# EAGLE design programmer9.0 (EAGLE 6.3)
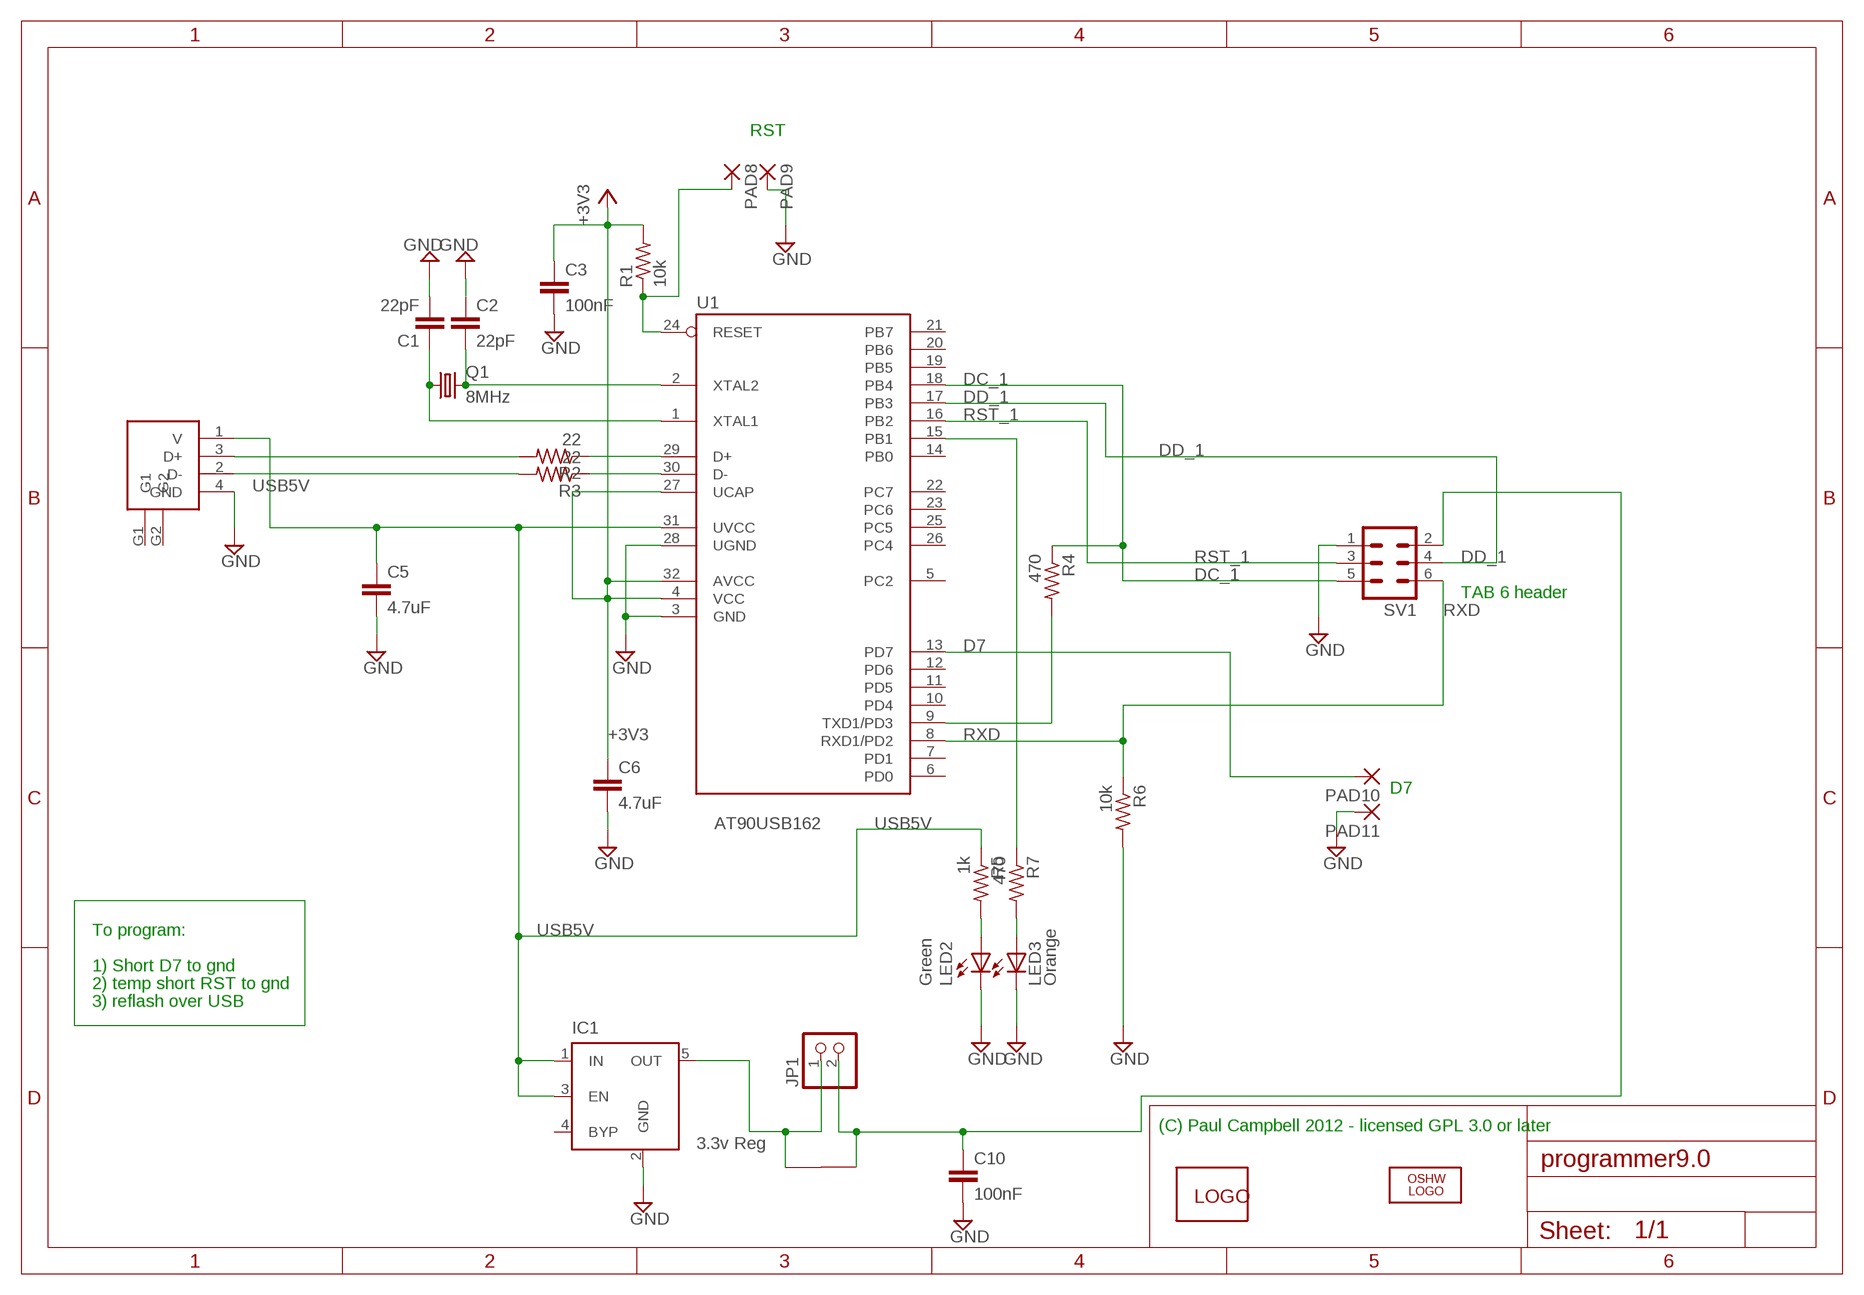
[diagram p0: schematic, sheet 1]

## Parts
C1  22pF  C-EUC0603  [C0603]
C2  22pF  C-EUC0603  [C0603]
C3  100nF  C-EUC0603  [C0603]
C5  4.7uF  C-EUC0805  [C0805]
C6  4.7uF  C-EUC0805  [C0805]
C10  100nF  C-EUC0603  [C0603]
IC1  3.3v Reg  MIC5219XX  [SOT23-5]
JP1  PINHD-1X2  [1X02]
LED2  Green  LEDCHIP-LED0805  [CHIP-LED0805]
LED3  Orange  LEDCHIP-LED0805  [CHIP-LED0805]
LOGO2  OSHW_LOGO_FILLX0100-NT  [OSHW_FILLX100_NOTEXT]
PAD8  1,6/0,8  [1,6/0,8]
PAD9  1,6/0,8  [1,6/0,8]
PAD10  1,6/0,8  [1,6/0,8]
PAD11  1,6/0,8  [1,6/0,8]
Q1  8MHz  CRYSTALHC49UP  [HC49UP]
R1  10k  R-US_R0603  [R0603]
R2  22  R-US_R0603  [R0603]
R3  22  R-US_R0603  [R0603]
R4  470  R-US_R0603  [R0603]
R5  1k  R-US_R0603  [R0603]
R6  10k  R-US_R0603  [R0603]
R7  470  R-US_R0603  [R0603]
SV1  MA03-2  [MA03-2]
U1  AT90USB162  [TQFP32-08]
U$1  LINK  [LINK]
U$2  MOONBASE-LOGO  [MOONBASE-LOGO]
U$3  USB-RAW  [USBY]

## Nets
+3V3: C3.1 C6.1 R1.2 U1.4(VCC) U1.27(UCAP) U1.32(AVCC)
D7: PAD10.1(P) U1.13(PD7)
DC_1: R4.1 SV1.5 U1.18(PB4)
DD_1: SV1.4 U1.17(PB3)
GND: C1.2 C2.1 C3.2 C5.2 C6.2 C10.2 IC1.2(GND) LED2.C LED3.C PAD9.1(P) PAD11.1(P) R6.2 SV1.1 U1.3(GND) U1.28(UGND) U$3.4(GND)
N$1: C1.1 Q1.1 U1.1(XTAL1)
N$2: C2.2 Q1.2 U1.2(XTAL2)
N$3: R2.1 U1.29(D+)
N$4: R3.1 U1.30(D-)
N$6: R4.2 U1.9(TXD1/PD3)
N$7: IC1.5(OUT) JP1.1 U$1.1
N$9: C10.1 JP1.2 SV1.2 U$1.2
N$10: R3.2 U$3.2(D-)
N$11: R2.2 U$3.3(D+)
N$18: LED2.A R5.2
N$22: LED3.A R7.2
N$23: R7.1 U1.15(PB1)
RST: PAD8.1(P) R1.1 U1.24(RESET)
RST_1: SV1.3 U1.16(PB2)
RXD: R6.1 SV1.6 U1.8(RXD1/PD2)
USB5V: C5.1 IC1.1(IN) IC1.3(EN) R5.1 U1.31(UVCC) U$3.1(V)
Unconnected: IC1.4(BYP) U1.5(PC2) U1.6(PD0) U1.7(PD1) U1.10(PD4) U1.11(PD5) U1.12(PD6) U1.14(PB0) U1.19(PB5) U1.20(PB6) U1.21(PB7) U1.22(PC7) U1.23(PC6) U1.25(PC5) U1.26(PC4) U$3.G1 U$3.G2

## Notes on the sheet
- RST
- TAB 6 header
- D7
- To program:
- 1) Short D7 to gnd
- 2) temp short RST to gnd
- 3) reflash over USB
- (C) Paul Campbell 2012 - licensed GPL 3.0 or later

## Library data of the parts
C1-C3 C5 C6 C10 = rcl:C-EU: CAPACITOR, European symbol
IC1 = v-reg-micrel:MIC5219XX: VOLTAGE REGULATOR; OC_FARNELL: unknown; OC_NEWARK: unknown
JP1 = pinhead:PINHD-1X2: PIN HEADER
LED2 LED3 = led:LED: LED OSRAM: - CHIPLED LG R971, LG N971, LY N971, LG Q971, LY Q971, LO R971, LY R971 LH N974, LH R974 LS Q976, LO Q976, LY Q976 LO Q996 - Hyper CHIPLED LW Q18S LB Q993, LB Q99A, LB R99A - SideLED LS A670, LO A670, LY A670, LG A670, LP A670 LB A673, LV A673, LT A673, LW A673 LH A674 LY A675 LS A676, LA A676, LO A676, LY A676, LW A676 LS A679, LY A679, LG A679 - Hyper Micro SIDELED® LS Y876, LA Y876, LO Y876, LY Y876 LT Y87S - SmartLED LW L88C, LW L88S LB L89C, LB L89S, LG L890 LS L89K, LO L89K, LY L89K LS L896, LA L896, LO L896, LY L896 - TOPLED LS T670, LO T670, LY T670, LG T670, LP T670 LSG T670, LSP T670, LSY T670, LOP T670, LYG T670 LG T671, LOG T671, LSG T671 LB T673, LV T673, LT T673, LW T673 LH T674 LS T676, LA T676, LO T676, LY T676, LB T676, LH T676, LSB T676, LW T676 LB T67C, LV T67C, LT T67C, LS T67K, LO T67K, LY T67K, LW E67C LS E67B, LA E67B, LO E67B, LY E67B, LB E67C, LV E67C, LT E67C LW T67C LS T679, LY T679, LG T679 LS T770, LO T770, LY T770, LG T770, LP T770 LB T773, LV T773, LT T773, LW T773 LH T774 LS E675, LA E675, LY E675, LS T675 LS T776, LA T776, LO T776, LY T776, LB T776 LHGB T686 LT T68C, LB T68C - Hyper Mini TOPLED® LB M676 - Mini TOPLED Santana® LG M470 LS M47K, LO M47K, LY M47K Source: http://www.osram.convergy.de LUXEON: - LUMILED® LXK2-PW12-R00, LXK2-PW12-S00, LXK2-PW14-U00, LXK2-PW14-V00 LXK2-PM12-R00, LXK2-PM12-S00, LXK2-PM14-U00 LXK2-PE12-Q00, LXK2-PE12-R00, LXK2-PE12-S00, LXK2-PE14-T00, LXK2-PE14-U00 LXK2-PB12-K00, LXK2-PB12-L00, LXK2-PB12-M00, LXK2-PB14-N00, LXK2-PB14-P00, LXK2-PB14-Q00 LXK2-PR12-L00, LXK2-PR12-M00, LXK2-PR14-Q00, LXK2-PR14-R00 LXK2-PD12-Q00, LXK2-PD12-R00, LXK2-PD12-S00 LXK2-PH12-R00, LXK2-PH12-S00 LXK2-PL12-P00, LXK2-PL12-Q00, LXK2-PL12-R00 Source: www.luxeon.com KINGBRIGHT: KA-3528ASYC Source: www.kingbright.com
LOGO2 = ohw-logo:OSHW_LOGO_FILL
PAD8-PAD11 = wirepad:1,6/0,8: THROUGH-HOLE PAD
Q1 = crystal:CRYSTAL: CRYSTAL; OC_FARNELL: unknown; OC_NEWARK: unknown
R1-R7 = rcl:R-US_: RESISTOR, American symbol
SV1 = con-lstb:MA03-2: PIN HEADER; OC_FARNELL: unknown; OC_NEWARK: unknown
U1 = atmelnew:AT90USB162
U$1 = playa:LINK
U$2 = ll:MOONBASE-LOGO
U$3 = playa:USB-RAW

## Board
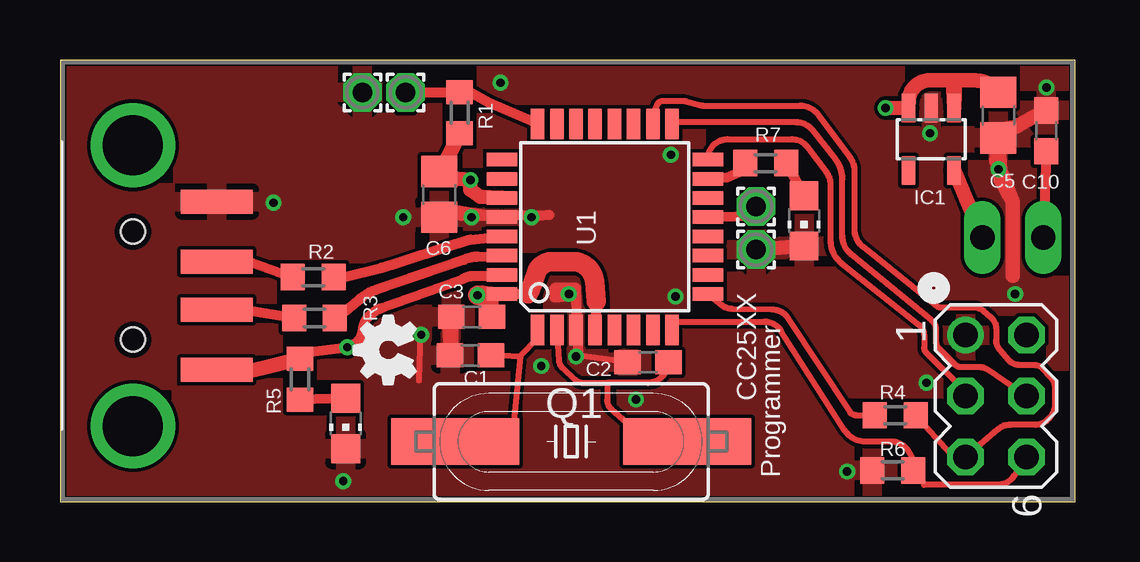
[diagram p1: board, top side]
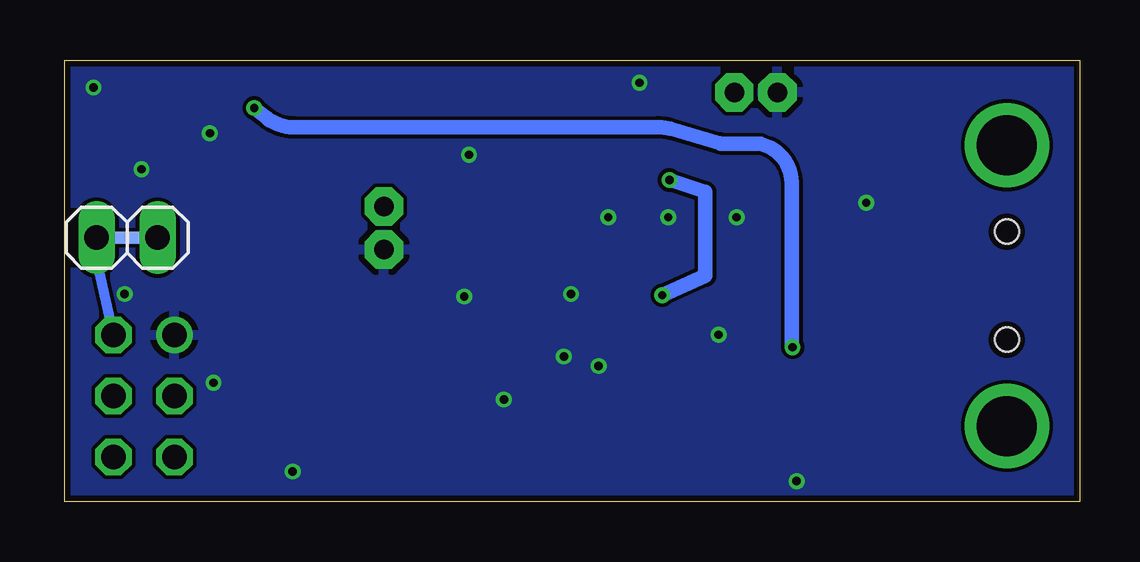
[diagram p2: board, bottom side, seen from below]

Size 42.3 x 18.4 mm. Coordinates in mm from the lower left corner, seen from the top.
Outline: 0,0 42.3,0 42.3,18.4 0,18.4 0,0
Copper layers (1*16): Top 0.035mm / dielectric 1.5mm / Bottom 0.035mm
Design rules "Fusion_eagle_rule_v1.1": minimum track width 6mil, minimum drill 12mil, track to track 6mil, track to pad 6mil, pad to pad 6mil, via to via 6mil, smd to smd 0mil, copper to edge 10mil, drill to drill 10mil, minimum pad ring 10mil, minimum via ring 6mil, stop-mask expansion 2mil, vias tented up to drill 100mil, thermal gap 10mil

### Footprints (pad centres in the part's own frame; a part is rotated, then mirrored left to right if it is on the bottom)
C0603 = smd 1.1 x 1: 1 -0.85,0; 2 0.85,0
C0805 = smd 1.3 x 1.5: 1 -0.95,0; 2 0.95,0
SOT23-5 = smd 0.55 x 1.2: 1 -0.95,-1.3; 2 0,-1.3; 3 0.95,-1.3; 4 0.95,1.3; 5 -0.95,1.3
1X02 = drill 1.016 long: 1 -1.27,0; 2 1.27,0
CHIP-LED0805 = smd 1.2 x 1.2: A 0,-1.05; C 0,1.05
1,6/0,8 = drill 0.813 pad 1.6 octagon: 1 0,0
HC49UP = smd 5.334 x 1.93: 1 -4.826,0; 2 4.826,0
R0603 = smd 1 x 1.1: 1 -0.85,0; 2 0.85,0
MA03-2 = drill 1.016: 1 -2.54,-1.27 | drill 1.016 octagon: 2 -2.54,1.27; 3 0,-1.27; 4 0,1.27; 5 2.54,-1.27; 6 2.54,1.27
TQFP32-08 = smd 1.27 x 0.559: 1 -4.293,2.8; 2 -4.293,2; 3 -4.293,1.2; 4 -4.293,0.4; 5 -4.293,-0.4; 6 -4.293,-1.2; 7 -4.293,-2; 8 -4.293,-2.8; 17 4.293,-2.8; 18 4.293,-2; 19 4.293,-1.2; 20 4.293,-0.4; 21 4.293,0.4; 22 4.293,1.2; 23 4.293,2; 24 4.293,2.8 | smd 0.559 x 1.27: 9 -2.8,-4.293; 10 -2,-4.293; 11 -1.2,-4.293; 12 -0.4,-4.293; 13 0.4,-4.293; 14 1.2,-4.293; 15 2,-4.293; 16 2.8,-4.293; 25 2.8,4.293; 26 2,4.293; 27 1.2,4.293; 28 0.4,4.293; 29 -0.4,4.293; 30 -1.2,4.293; 31 -2,4.293; 32 -2.8,4.293
LINK = smd 2 x 0.5: 1 -1,0; 2 1,0
USBY = smd 1 x 3: 1 3.5,3.5; 2 1,3.5; 3 -1,3.5; 4 -3.5,3.5 | drill 2.5: G1 5.85,0; G2 -5.85,0 | hole 1: -2.25,0; 2.25,0

### Placement (x,y rotation side)
C1  17.1,6.1 180 top
C2  24.5,5.8 0 top
C3  17.15,7.7 180 top
C5  39.1,16.1 270 top
C6  15.8,12.8 270 top
C10  41.1,15.45 90 top
IC1  36.3,15.1 180 top
JP1  39.7,11 180 bottom
LED2  11.9,3.25 180 top
LED3  31,11.7 180 top
LOGO2  14.8,4.9 90 top
PAD8  14.4,17.05 0 top
PAD9  12.6,17.05 0 top
PAD10  29,12.3 0 top
PAD11  29,10.5 0 top
Q1  21.3,2.5 0 top
R1  16.65,16.2 270 top
R2  10.55,9.35 180 top
R3  10.6,7.65 180 top
R4  34.8,3.6 180 top
R5  10,5.1 270 top
R6  34.7,1.3 180 top
R7  29.4,14.1 0 top
SV1  39,4.4 270 top
U1  22.7,11.45 90 top
U$1  39.7,11 180 bottom
U$2  35.7,5.6 90 top
U$3  3.04,9 270 top

### Tracks (layer width: path | path; a pad name or v marks a point on that pad's centre or on a via)
+3V3  (via drill 0.35)
  Top 0.406: 17.51,8.7 17.95,8.55 U1.32 19.5,8.65 | U1.4 22.35,8.35 22.2,8.6 | v17.1,13.4 16.15,13.4
  Top 0.61: U1.27 17.5,12.7 17.1,13 v17.1,13.4 | R1.2 16.1,14.2 15.6,13.6 15.9,13.5 v17.1,13.4 | v17.1,13.4 16.1,13.5 C6.1 | v17.4,8.6 17.95,8.55 18,7.9 C3.1
  Top 0.813: 19.5,8.65 19.6,8.8 19.84,9.51 arc-72 20.52,10 21.36,10 arc-85 22.28,9.16 22.35,8.35 | 17.95,8.55 17.59,8.61 v17.4,8.6
  Bottom 0.61: v17.1,13.4 15.6,12.9 15.6,9.4 v17.4,8.6
D7
  Top 0.406: U1.13 28.7,11.9 28.8,12.1 PAD10.1
DC_1
  Top 0.254: U1.18 24.85,16.46 arc-78 25.14,16.7 25.94,16.7 arc-16 26.05,16.68 26.61,16.53 arc16 26.8,16.5 30.84,16.5 arc-53 31.58,16.13 32.9,14.37 arc-37 33.1,13.77 33.1,11.33 arc51 33.44,10.63 36.6,8.1 38.08,8.1 arc-41 38.47,7.95 38.79,7.68 arc-49 39,7.22 39,6.72 arc41 39.15,6.33 39.52,5.91 arc49 39.97,5.7 40.58,5.7 arc-47 40.95,5.54 41.29,5.17 arc-43 41.45,4.76 41.45,3.97 arc-37 41.35,3.67 41.21,3.48 arc-53 40.65,3.2 39.59,3.2 arc40 39.08,3.01 SV1.5 37.36,1.89 arc-43 37.09,2.02 R4.1
DD_1
  Top 0.254: SV1.4 38.66,5.5 arc34 38.31,5.6 37.57,5.6 arc-45 37.28,5.72 36.65,6.35 arc-45 36.5,6.71 36.5,7.16 arc51 36.32,7.55 32.97,10.3 arc-51 32.6,11.07 32.6,13.45 arc38 32.32,14.25 31.36,15.47 arc52 30.69,15.8 25.7,15.8 25.6,16 25.5,15.9
  Top 0.406: 25.5,15.9 U1.17
GND  (via drill 0.35)
  Top 0.254: 15,7.1 14.95,5.05 | C2.1 21.5,6.1 v21.5,6.05
  Top 0.406: v21.5,6.05 21.6,6.3 21.5,8.5 21.5,8.9 20.6,8.9 20.6,8.5 21.5,8.6 U1.3 | v19.65,11.85 20.4,11.95 16.7,11.9 U1.28 16.5,12.15
  Top 0.61: LED3.C PAD11.1 | C10.2 39.97,15.69 arc-19 39.61,15.57 39.2,15.5 39,14.2 39.7,12.5 | 39.7,9.4 39.7,12.5 | 39.7,12.5 39.2,13.4 C5.2 | C3.2 16.3,6 16.2,7.7
  other vias: 32.8,1.25 39.1,13.85 14.3,11.85 11.8,0.85 25.65,8.55 25.45,14.45 15.05,6.95 8.9,12.45 20.05,5.65 36.25,15.35 18.35,17.45 36.1,4.95 41.1,17.25 39.8,8.65 24,4.25 17.15,11.85 21.2,8.65
  pour Bottom: 0,18.4 0,0 42.3,0 42.3,18.4
  pour Top: 0,18.4 0,0 42.3,0 42.3,18.4
N$1
  Top 0.254: U1.1 19.9,6.8 19.19,6.06 | 19.19,6.06 18.9,3.3 Q1.1 | C1.1 18.4,6.1 19.19,6.06
N$2
  Top 0.254: U1.2 20.79,5.9 arc43 20.94,5.57 21.45,5.09 arc43 21.8,4.95 22.8,4.95 | 22.8,4.95 22.8,4.23 arc49 22.97,3.85 23.6,3.3 Q1.2 | C2.2 25.27,5.53 arc-74 24.5,4.95 22.8,4.95
N$3
  Top 0.406: U1.29 17.11,10.91 arc12 16.89,10.87 13.4,9.75 11.8,9.35 11.55,9.2 R2.1
N$4
  Top 0.406: U1.30 17.4,10.21 arc22 16.83,10.07 13.16,8.82 arc21 12.51,8.46 11.6,7.7 11.35,7.65 R3.1
N$6
  Top 0.254: U1.9 27.58,8.19 arc37 27.97,8.04 29.68,8.01 arc-55 30.33,7.65 32.91,3.74 arc57 33.17,3.6 R4.2
N$7
  Top 0.61: IC1.5 JP1.1
  Bottom 0.406: JP1.1 U$1.1
N$9
  Top 0.406: C10.1 JP1.2
  Bottom 0.406: SV1.2 40.97,10 U$1.2 JP1.2
N$10
  Top 0.406: 7,7.9 7.7,8 R3.2
  Top 0.813: U$3.2 7,7.9
N$11
  Top 0.406: 7.4,10.05 7.9,10 R2.2
  Top 0.813: U$3.3 7.4,10.05
N$18
  Top 0.406: LED2.A R5.2
N$22
  Top 0.406: R7.2 LED3.A
N$23
  Top 0.406: R7.1 28.5,13.8 27.8,13.5 U1.15
RST
  Top 0.406: U1.24 17.9,16.6 17,17.1 R1.1 PAD8.1
RST_1
  Top 0.254: U1.16 27.01,14.39 arc-83 27.81,15.1 30.51,15.1 arc-53 31.13,14.79 31.92,13.74 arc-37 32.1,13.2 32.1,10.88 arc52 32.55,9.94 35.81,7.35 arc-52 36,6.96 36,6.43 arc45 36.09,6.21 37.5,4.8 38,4.4 SV1.3
RXD
  Top 0.254: U1.8 25.5,7.5 29.36,7.5 arc-57 30.04,7.13 32.7,2.96 arc57 33.55,2.5 34.61,2.5 arc-66 35.44,1.96 35.7,1.39 | SV1.6 39.74,1.06 arc-56 39.07,0.7 36,0.7 35.7,1.39 | R6.1 35.7,1.39
USB5V  (via drill 0.35)
  Top 0.254: R5.1 10.1,6.2
  Top 0.406: U1.31 17.8,9.4 17.22,9.4 arc30 16.81,9.29 13.41,8.08 arc20 13.03,7.86 12.94,7.79 arc47 12.62,7.18 arc-52 12.29,6.59 12.15,6.5 arc-25 v11.97,6.43 10.1,6.2 | 5.9,5.3 6.54,5.48
  Top 0.61: 37.2,17.55 36.24,17.55 arc88 35.36,16.71 IC1.3 v34.4,16.4 | 37.3,17.55 IC1.1 37.2,17.55 | 37.2,17.55 37.3,17.55 | 37.3,17.55 38.13,17.55 arc-51 39.05,17.11 C5.1 | 6.54,5.48 7.1,5.5 7.8,5.4 R5.1 | U$3.1 5.9,5.3
  Bottom 0.406: v11.97,6.43 12,6.5
  Bottom 0.61: 12,6.5 12,13.15 arc-63 12.89,14.75 13.3,14.9 14.79,14.9 arc16 15.01,14.93 17.05,15.53 arc-16 17.56,15.6 32.78,15.6 arc39 33.88,15.99 v34.4,16.4

### Text on the board
tNames: CC25XX | Programmer
tDocu: RST | (C) Paul / Campbell / 2013 | D7 | V9.0